# Altium schematic sheet Dyagram.SchDoc: AERO Geek
size A4; ApprovedBy: NCOPamp; CheckedBy: NCOPamp; Author: NCOPamp; CompanyName: VECTOR Di-gi; DrawnBy: NCOPamp; Engineer: NCOPamp; Organization: VECTOR Di-gi; DocumentNumber: 1; Revision: 1.1; SheetNumber: 1; SheetTotal: 1; DocumentName: Mother Board; ProjectName: Project A.E.R.O.; Application_BuildNumber: 2
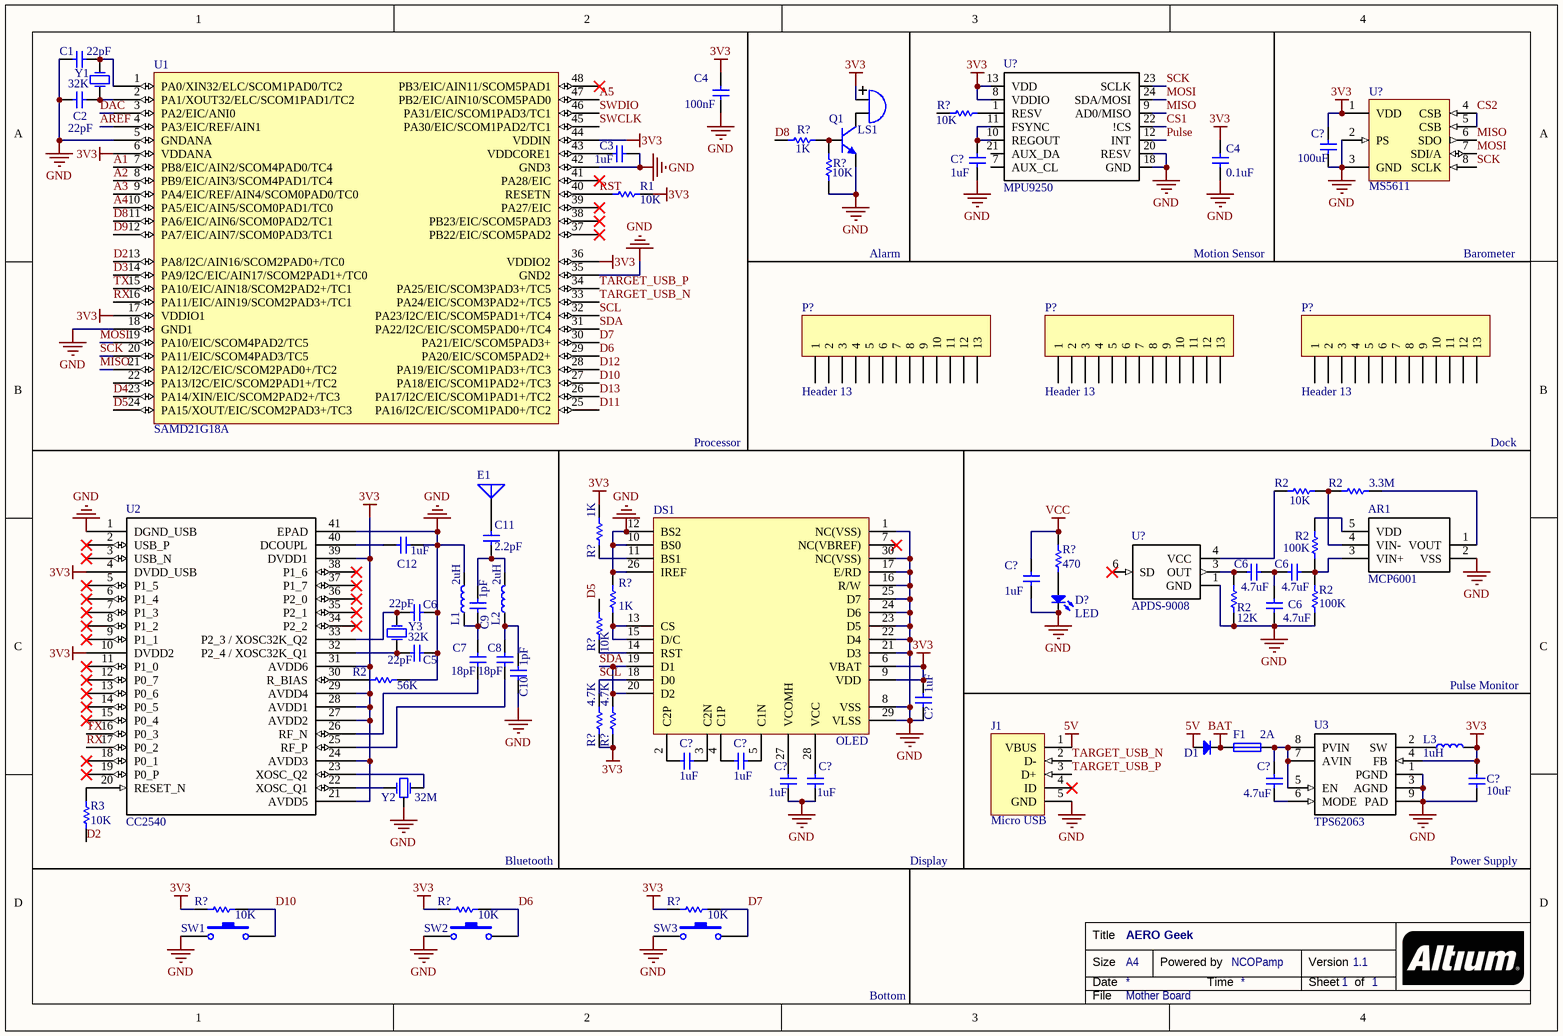
[diagram p0: Dyagram.SchDoc]

## Parts
(Parts that share a designator on the sheet are numbered #1, #2 ... from top to bottom, then left to right.)
AR1  MCP6001  [SOT23-5]
C1  value 22pF  [0603]  (hidden comment: CAP)
C2  value 22pF  [0603]  (hidden comment: CAP)
C3  value 1uF  [0603]  (hidden comment: CAP)
C4#1  value 100nF  [0402]  (hidden comment: CAP)
C4#2  value 0.1uF  [0402]  (hidden comment: CAP)
C5  value 22pF  [0402]  (hidden comment: CAP)
C6#1  value 4.7uF  [0402]  (hidden comment: CAP)
C6#2  value 4.7uF  [0402]  (hidden comment: CAP)
C6#3  value 4.7uF  [0402]  (hidden comment: CAP)
C6#4  value 22pF  [0402]  (hidden comment: CAP)
C7  value 18pF  [0402]  (hidden comment: CAP)
C8  value 18pF  [0402]  (hidden comment: CAP)
C9  value 1pF  [0402]  (hidden comment: CAP)
C10  value 1pF  [0402]  (hidden comment: CAP)
C11  value 2.2pF  [0402]  (hidden comment: CAP)
C12  value 1uF  [0402]  (hidden comment: CAP)
C?#1  value 100uF  [0402]  (hidden comment: CAP)
C?#2  value 1uF  [0402]  (hidden comment: CAP)
C?#3  value 1uF  [0402]  (hidden comment: CAP)
C?#4  value 1uF  [0402]  (hidden comment: CAP)
C?#5  value 1uF  [0402]  (hidden comment: CAP)
C?#6  value 1uF  [0402]  (hidden comment: CAP)
C?#7  value 1uF  [0402]  (hidden comment: CAP)
C?#8  value 1uF  [0402]  (hidden comment: CAP)
C?#9  value 4.7uF  [0402]  (hidden comment: CAP)
C?#10  value 10uF  [0402]  (hidden comment: CAP)
D1  Diode  [Diode-SOC]  (value not drawn)
D?  LED  [0805]
DS1  OLED  [COG]
E1  Antenna  [A6150]  (value not drawn)
F1  value 2A  [1812]  (hidden comment: Fuse)
J1  Micro USB  [Micro Type-B]
L1  value 2uH  [0402]  (hidden comment: Inductor)
L2  value 2uH  [0402]  (hidden comment: Inductor)
L3  value 1uH  [0402]  (hidden comment: Inductor)
LS1  Buzzer  [420]  (value not drawn)
P?#1  Header 13  [HDR1X13]
P?#2  Header 13  [HDR1X13]
P?#3  Header 13  [HDR1X13]
Q1  NPN  [SOT23]  (value not drawn)
R1  value 10K  [0402]  (hidden comment: RES)
R2#1  value 10K  [0402]  (hidden comment: RES)
R2#2  value 3.3M  [0402]  (hidden comment: RES)
R2#3  value 100K  [0402]  (hidden comment: RES)
R2#4  value 12K  [0402]  (hidden comment: RES)
R2#5  value 100K  [0402]  (hidden comment: RES)
R2#6  value 56K  [0402]  (hidden comment: RES)
R3  value 10K  [0402]  (hidden comment: RES)
R?#1  value 10K  [0402]  (hidden comment: RES)
R?#2  value 1K  [0402]  (hidden comment: RES)
R?#3  value 10K  [0402]  (hidden comment: RES)
R?#4  value 1K  [0402]  (hidden comment: RES)
R?#5  value 470  [0402]  (hidden comment: RES)
R?#6  value 1K  [0402]  (hidden comment: RES)
R?#7  value 10K  [0402]  (hidden comment: RES)
R?#8  value 4.7K  [0402]  (hidden comment: RES)
R?#9  value 4.7K  [0402]  (hidden comment: RES)
R?#10  value 10K  [0402]  (hidden comment: RES)
R?#11  value 10K  [0402]  (hidden comment: RES)
R?#12  value 10K  [0402]  (hidden comment: RES)
SW1  SW  [SW-PB2]  (value not drawn)
SW2  SW  [SW-PB2]  (value not drawn)
SW3  SW  [SW-PB2]  (value not drawn)
U1  SAMD21G18A  [QFN48]
U2  CC2540  [VQFN40]
U3  TPS62063  [DSG08]
U?#1  MPU9250  [QFN24]
U?#2  MS5611  [QFN8]
U?#3  APDS-9008  [chipLED-6P]
Y1  value 32K  [ABS07]  (hidden comment: XTAL)
Y2  value 32M  [X-CPX20]  (hidden comment: XTAL-3P)
Y3  value 32K  [ABS07]  (hidden comment: XTAL)

## Nets
3V3: C4#1.2 C4#2.2 C?#1.2 C?#4.1 C?#10.2 DS1.6(VBAT) DS1.9(VDD) L3.2 LS1.1(A) R1.2 R?#4.1 R?#8.2 R?#9.2 R?#10.1 R?#11.1 R?#12.1 U1.6(VDDANA) U1.17(VDDIO1) U1.36(VDDIO2) U1.44(VDDIN) U2.4(DVDD_USB) U2.10(DVDD2) U2.21(AVDD5) U2.24(AVDD3) U2.27(AVDD2) U2.28(AVDD1) U2.29(AVDD4) U2.31(AVDD6) U2.39(DVDD1) U3.4(FB) U?#1.8(VDDIO) U?#1.13(VDD) U?#2.1(VDD)
5V: D1.1(A) J1.1(VBUS)
BAT: D1.2(K) F1.1
GND: AR1.2(VSS) C1.1 C2.1 C3.2 C4#1.1 C4#2.1 C5.2 C6#3.1 C6#4.2 C10.1 C12.2 C?#1.1 C?#2.2 C?#3.1 C?#4.2 C?#7.2 C?#8.1 C?#10.1 D?.2(K) DS1.1(NC(VSS)) DS1.8(VSS) DS1.10(BS0) DS1.12(BS2) DS1.16(R/W) DS1.17(E/RD) DS1.21(D3) DS1.22(D4) DS1.23(D5) DS1.24(D6) DS1.25(D7) DS1.26(IREF) DS1.29(VLSS) DS1.30(NC(VSS)) J1.5(GND) L1.2 Q1.1(E) R2#4.2 R2#5.2 R2#6.2 R?#3.1 R?#6.1 SW1.1 SW2.1 SW3.1 U1.5(GNDANA) U1.18(GND1) U1.35(GND2) U1.42(GND3) U2.1(DGND_USB) U2.41(EPAD) U3.1(PGND) U3.3(AGND) U3.9(PAD) U?#1.18(GND) U?#1.20(RESV) U?#2.2(PS) U?#2.3(GND) U?#3.1(GND) Y2.2(GND)
VCC: C?#3.2 R?#5.2
A1: U1.7(PB8/EIC/AIN2/SCOM4PAD0/TC4)
A2: U1.8(PB9/EIC/AIN3/SCOM4PAD1/TC4)
A3: U1.9(PA4/EIC/REF/AIN4/SCOM0PAD0/TC0)
A4: U1.10(PA5/EIC/AIN5/SCOM0PAD1/TC0)
A5: U1.47(PB2/EIC/AIN10/SCOM5PAD0)
AREF: U1.4(PA3/EIC/REF/AIN1)
CS1: U?#1.22(!CS)
CS2: U?#2.4(CSB) U?#2.5(CSB)
D2: R3.1 U1.13(PA8/I2C/AIN16/SCOM2PAD0+/TC0)
D3: U1.14(PA9/I2C/EIC/AIN17/SCOM2PAD1+/TC0)
D4: U1.23(PA14/XIN/EIC/SCOM2PAD2+/TC3)
D5: R?#7.2 U1.24(PA15/XOUT/EIC/SCOM2PAD3+/TC3)
D6: R?#11.2 SW2.2 U1.29(PA20/EIC/SCOM5PAD2+)
D7: R?#12.2 SW3.2 U1.30(PA21/EIC/SCOM5PAD3+)
D8: R?#2.1 U1.11(PA6/EIC/AIN6/SCOM0PAD2/TC1)
D9: U1.12(PA7/EIC/AIN7/SCOM0PAD3/TC1)
D10: R?#10.2 SW1.2 U1.27(PA18/EIC/SCOM1PAD2+/TC3)
D11: U1.25(PA16/I2C/EIC/SCOM1PAD0+/TC2)
D12: U1.28(PA19/EIC/SCOM1PAD3+/TC3)
D13: U1.26(PA17/I2C/EIC/SCOM1PAD1+/TC2)
DAC: U1.3(PA2/EIC/ANI0)
MISO: U1.21(PA12/I2C/EIC/SCOM2PAD0+/TC2) U?#1.9(AD0/MISO) U?#2.6(SDO)
MOSI: U1.19(PA10/EIC/SCOM4PAD2/TC5) U?#1.24(SDA/MOSI) U?#2.7(SDI/A)
Pulse: U?#1.12(INT)
RST: R1.1 U1.40(RESETN)
RX: U1.16(PA11/EIC/AIN19/SCOM2PAD3+/TC1) U2.17(P0_2)
SCK: U1.20(PA11/EIC/SCOM4PAD3/TC5) U?#1.23(SCLK) U?#2.8(SCLK)
SCL: DS1.18(D0) R?#8.1 U1.32(PA23/I2C/EIC/SCOM5PAD1+/TC4)
SDA: DS1.19(D1) DS1.20(D2) R?#9.1 U1.31(PA22/I2C/EIC/SCOM5PAD0+/TC4)
SWCLK: U1.45(PA30/EIC/SCOM1PAD2/TC1)
SWDIO: U1.46(PA31/EIC/SCOM1PAD3/TC1)
TARGET_USB_N: J1.2(D-) U1.33(PA24/EIC/SCOM3PAD2+/TC5)
TARGET_USB_P: J1.3(D+) U1.34(PA25/EIC/SCOM3PAD3+/TC5)
TX: U1.15(PA10/EIC/AIN18/SCOM2PAD2+/TC1) U2.16(P0_3)
NetAR1_1: AR1.1(VOUT) R2#2.2
NetAR1_3: AR1.3(VIN+) C6#2.2 R2#3.2 R2#5.1
NetAR1_4: AR1.4(VIN-) R2#1.2 R2#2.1
NetAR1_5: AR1.5(VDD) R2#3.1
NetC1_2: C1.2 U1.1(PA0/XIN32/ELC/SCOM1PAD0/TC2) Y1.2(OSC2)
NetC2_2: C2.2 U1.2(PA1/XOUT32/ELC/SCOM1PAD1/TC2) Y1.1(OSC1)
NetC3_1: C3.1 U1.43(VDDCORE1)
NetC5_1: C5.1 U2.32(P2_4_/_XOSC32K_Q1) Y3.1(OSC1)
NetC6#1_1: C6#1.1 R2#4.1 U?#3.3(OUT)
NetC6#1_2: C6#1.2 C6#2.1 C6#3.2
NetC6#4_1: C6#4.1 U2.33(P2_3_/_XOSC32K_Q2) Y3.2(OSC2)
NetC7_1: C7.1 U2.26(RF_N)
NetC7_2: C7.2 C9.1 L1.1
NetC8_1: C8.1 U2.25(RF_P)
NetC8_2: C8.2 C10.2 L2.1
NetC9_2: C9.2 C11.1 L2.2
NetC11_2: C11.2 E1.1(A)
NetC12_1: C12.1 U2.40(DCOUPL)
NetC?#2_1: C?#2.1 U?#1.10(REGOUT) U?#1.11(FSYNC)
NetC?#5_1: C?#5.1 DS1.3(C2N)
NetC?#5_2: C?#5.2 DS1.2(C2P)
NetC?#6_1: C?#6.1 DS1.5(C1N)
NetC?#6_2: C?#6.2 DS1.4(C1P)
NetC?#7_1: C?#7.1 DS1.27(VCOMH)
NetC?#8_2: C?#8.2 DS1.28(VCC)
NetC?#9_1: C?#9.1 U3.6(MODE)
NetC?#9_2: C?#9.2 F1.2 U3.5(EN) U3.7(AVIN) U3.8(PVIN)
NetD?_1: D?.1(A) R?#5.1
NetDS1_11: DS1.11(BS1) R?#4.2
NetDS1_13: DS1.13(CS) DS1.15(D/C) R?#6.2
NetDS1_14: DS1.14(RST) R?#7.1
NetL3_1: L3.1 U3.2(SW)
NetLS1_2: LS1.2(B) Q1.3(C)
NetQ1_2: Q1.2(B) R?#2.2 R?#3.2
NetR2#1_1: R2#1.1 U?#3.4(VCC)
NetR2#6_1: R2#6.1 U2.30(R_BIAS)
NetR3_2: R3.2 U2.20(RESET_N)
NetR?#1_2: R?#1.2 U?#1.1(RESV)
NetU2_22: U2.22(XOSC_Q1) Y2.3(OSC2)
NetU2_23: U2.23(XOSC_Q2) Y2.1(OSC1)

Not connected (* = marked no-connect by the designer): DS1 7(NC(VBREF))*; J1 4(ID)*; P?#1 1 2 3 4 5 6 7 8 9 10 11 12 13; P?#2 1 2 3 4 5 6 7 8 9 10 11 12 13; P?#3 1 2 3 4 5 6 7 8 9 10 11 12 13; R?#1 1; U1 22(PA13/I2C/EIC/SCOM2PAD1+/TC2) 37(PB22/EIC/SCOM5PAD2)* 38(PB23/EIC/SCOM5PAD3)* 39(PA27/EIC)* 41(PA28/EIC)* 48(PB3/EIC/AIN11/SCOM5PAD1)*; U2 2(USB_P)* 3(USB_N)* 5(P1_5)* 6(P1_4)* 7(P1_3)* 8(P1_2)* 9(P1_1)* 11(P1_0)* 12(P0_7)* 13(P0_6)* 14(P0_5)* 15(P0_4)* 18(P0_1)* 19(P0_P)* 34(P2_2)* 35(P2_1)* 36(P2_0)* 37(P1_7)* 38(P1_6)*; U?#1 7(AUX_CL) 21(AUX_DA); U?#3 6(SD)*

## Notes on the sheet
- Alarm
- Motion Sensor
- Barometer
- Processor
- Dock
- Pulse Monitor
- Bluetooth
- Display
- Power Supply
- Title
- Size
- Date
- A4
- Powered by
- Time
- Version
- Sheet
- of
- Bottom
- File
- Size:
- Date:
- Number:
- Time:
- Revision:
- File:

## Library data of the parts
AR1 = MCP6001: Op Amp
C1-C3 C4#1 C4#2 C5 C6#1-C6#4 C7-C12 C?#1-C?#10 = CAP: Capacitor
DS1 = OLED: 0.96inch 12864 Screen
LS1 = Buzzer: Magnetic Transducer Buzzer
P?#1-P?#3 = Header 13: Header, 13-Pin; LatestRevisionDate: 17-Jul-2002; LatestRevisionNote: Re-released for DXP Platform.; Publisher: Altium Limited
Q1 = NPN: NPN Bipolar Transistor
R1 R2#1-R2#6 R3 R?#1-R?#12 = RES: Resistor
SW1-SW3 = SW: Switch
U1 = SAMD21G18A: Arduino MCU; Value: *
U2 = CC2540: Bluetooth MCU
U3 = TPS62063: DC-DC Converter
U?#1 = MPU9250: Gyroscope/Accelerometer/Magnetometer Sensor
U?#2 = MS5611: Pressure Sensor
U?#3 = APDS-9008: Ambient Light Sensor
Y1 Y3 = XTAL: Crystal Oscillator
Y2 = XTAL-3P: Crystal Oscillator